# Altium schematic sheet SRAM.SchDoc
size A4
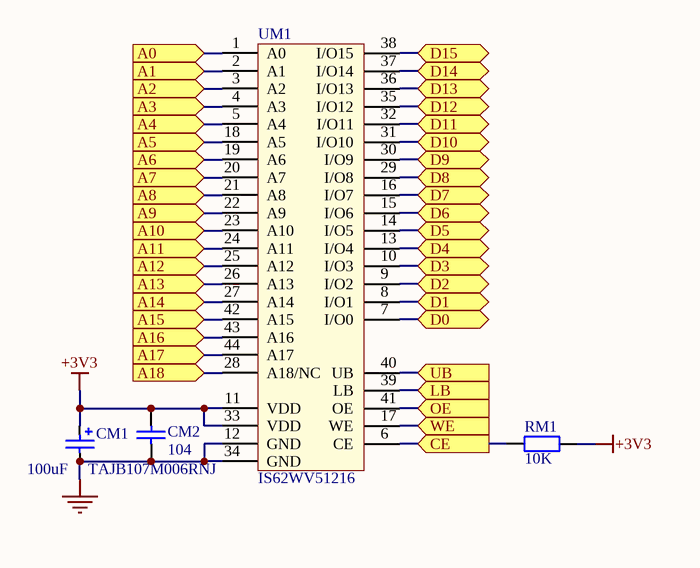
[diagram p0: SRAM.SchDoc]

## Parts
CM1  value 100uF     TAJB107M006RNJ  [CAP_TAN_B_3518]  (hidden comment: Cap_Tan)
CM2  value 104  [CAPC1608N]  (hidden comment: Cap1)
RM1  value 10K  [RESC1608N]  (hidden comment: Res1)
UM1  IS62WV51216  [TSOP44]

## Ports
A0 (in), A1 (in), A2 (in), A3 (in), A4 (in), A5 (in), A6 (in), A7 (in), A8 (in), A9 (in), A10 (in), A11 (in), A12 (in), A13 (in), A14 (in), A15 (in), A16 (in), A17 (in), A18 (in), CE (in), D0 (bidir), D1 (bidir), D2 (bidir), D3 (bidir), D4 (bidir), D5 (bidir), D6 (bidir), D7 (bidir), D8 (bidir), D9 (bidir), D10 (bidir), D11 (bidir), D12 (bidir), D13 (bidir), D14 (bidir), D15 (bidir), LB (in), OE (in), UB (in), WE (in)

## Nets
+3V3: CM1.1 CM2.2 RM1.1 UM1.11(VDD) UM1.33(VDD)
GND: CM1.2 CM2.1 UM1.12(GND) UM1.34(GND)
A0: UM1.1(A0) ; port A0
A1: UM1.2(A1) ; port A1
A2: UM1.3(A2) ; port A2
A3: UM1.4(A3) ; port A3
A4: UM1.5(A4) ; port A4
A5: UM1.18(A5) ; port A5
A6: UM1.19(A6) ; port A6
A7: UM1.20(A7) ; port A7
A8: UM1.21(A8) ; port A8
A9: UM1.22(A9) ; port A9
A10: UM1.23(A10) ; port A10
A11: UM1.24(A11) ; port A11
A12: UM1.25(A12) ; port A12
A13: UM1.26(A13) ; port A13
A14: UM1.27(A14) ; port A14
A15: UM1.42(A15) ; port A15
A16: UM1.43(A16) ; port A16
A17: UM1.44(A17) ; port A17
A18: UM1.28(A18/NC) ; port A18
CE: RM1.2 UM1.6(CE) ; port CE
D0: UM1.7(I/O0) ; port D0
D1: UM1.8(I/O1) ; port D1
D2: UM1.9(I/O2) ; port D2
D3: UM1.10(I/O3) ; port D3
D4: UM1.13(I/O4) ; port D4
D5: UM1.14(I/O5) ; port D5
D6: UM1.15(I/O6) ; port D6
D7: UM1.16(I/O7) ; port D7
D8: UM1.29(I/O8) ; port D8
D9: UM1.30(I/O9) ; port D9
D10: UM1.31(I/O10) ; port D10
D11: UM1.32(I/O11) ; port D11
D12: UM1.35(I/O12) ; port D12
D13: UM1.36(I/O13) ; port D13
D14: UM1.37(I/O14) ; port D14
D15: UM1.38(I/O15) ; port D15
LB: UM1.39(LB) ; port LB
OE: UM1.41(OE) ; port OE
UB: UM1.40(UB) ; port UB
WE: UM1.17(WE) ; port WE

## Library data of the parts
CM1 = Cap_Tan: Capacitor
CM2 = Cap1: Capacitor; Published: 8-Jun-2000; LatestRevisionDate: 17-Jul-2002; LatestRevisionNote: Re-released for DXP Platform.; PackageReference: RAD-0.3; Publisher: Altium Limited
RM1 = Res1: Resistor; Published: 8-Jun-2000; LatestRevisionDate: 17-Jul-2002; LatestRevisionNote: Re-released for DXP Platform.; PackageReference: AXIAL-0.4; Publisher: Altium Limited
UM1 = IS61LV51216